# Altium schematic sheet SH1 - HSD.SchDoc: HSD
size B; Engineer: Tibi Andronescu; Revision: 1; SheetNumber: 1; SheetTotal: 1
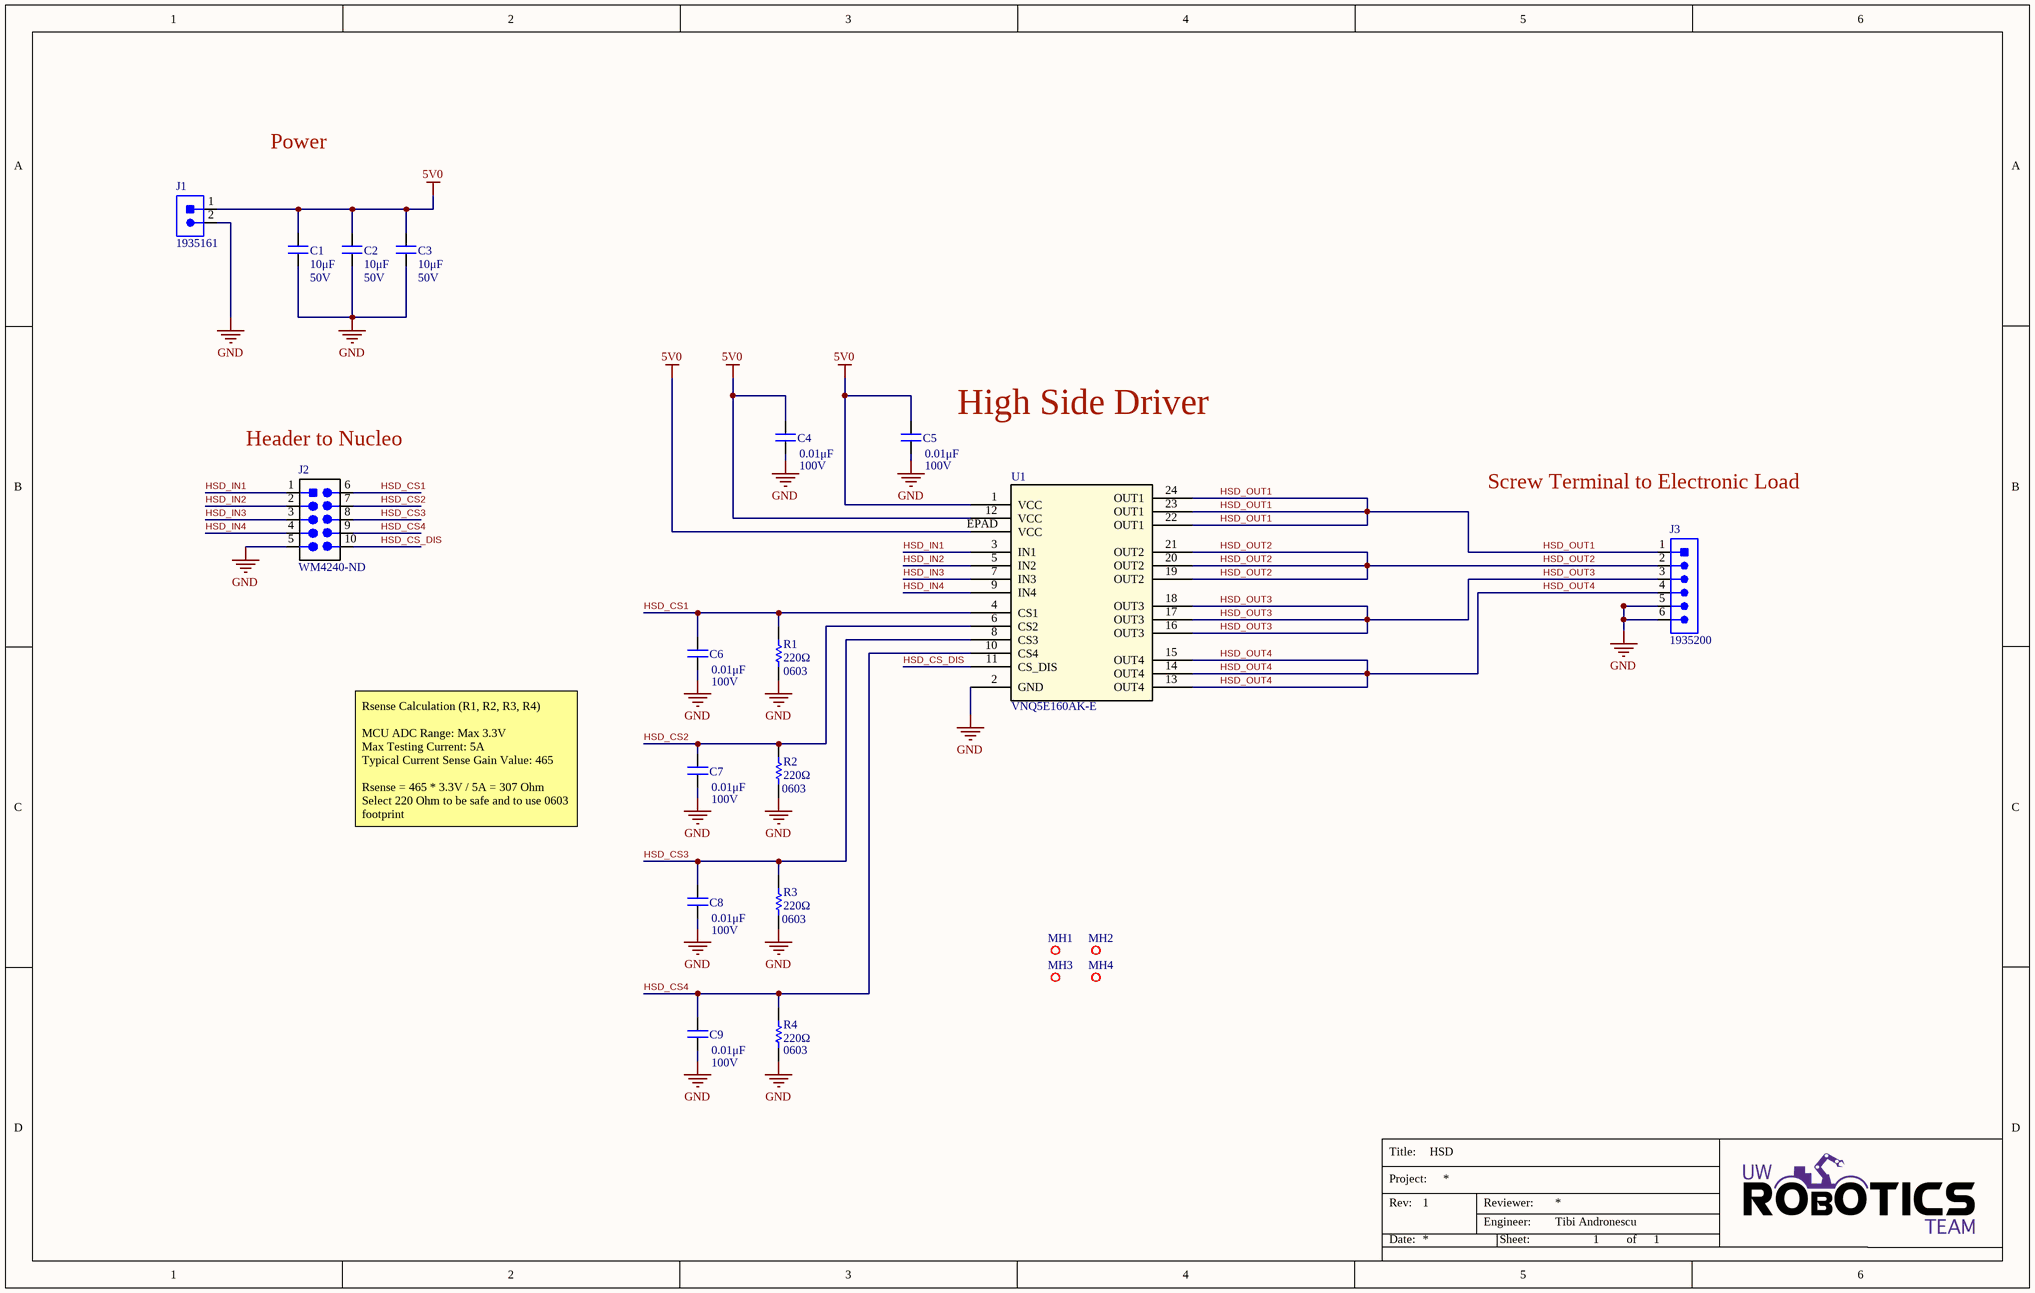
[diagram p0: SH1 - HSD.SchDoc]

## Parts
C1  value 10μF  Voltage Rating: 50V  [CAP1206]  (hidden comment: CAP_10uF_50V_1206)
C2  value 10μF  Voltage Rating: 50V  [CAP1206]  (hidden comment: CAP_10uF_50V_1206)
C3  value 10μF  Voltage Rating: 50V  [CAP1206]  (hidden comment: CAP_10uF_50V_1206)
C4  value 0.01μF  Voltage Rating: 100V  [CAP0603]  (hidden comment: CAP_0.01uF_100V_0603)
C5  value 0.01μF  Voltage Rating: 100V  [CAP0603]  (hidden comment: CAP_0.01uF_100V_0603)
C6  value 0.01μF  Voltage Rating: 100V  [CAP0603]  (hidden comment: CAP_0.01uF_100V_0603)
C7  value 0.01μF  Voltage Rating: 100V  [CAP0603]  (hidden comment: CAP_0.01uF_100V_0603)
C8  value 0.01μF  Voltage Rating: 100V  [CAP0603]  (hidden comment: CAP_0.01uF_100V_0603)
C9  value 0.01μF  Voltage Rating: 100V  [CAP0603]  (hidden comment: CAP_0.01uF_100V_0603)
J1  CON_2M_TERM  [1935161]  (value not drawn)
J2  Supplier Part Number 1: WM4240-ND  [HEADER 2X5]  (hidden comment: HEADER 5x2)
J3  CON_6POS_SCREW_TERM  [1935200]  (value not drawn)
MH1  MOUNTING_HOLE_M3  [MOUNTING_HOLE_3mm]  (value not drawn)  (no BOM)
MH2  MOUNTING_HOLE_M3  [MOUNTING_HOLE_3mm]  (value not drawn)  (no BOM)
MH3  MOUNTING_HOLE_M3  [MOUNTING_HOLE_3mm]  (value not drawn)  (no BOM)
MH4  MOUNTING_HOLE_M3  [MOUNTING_HOLE_3mm]  (value not drawn)  (no BOM)
R1  value 220Ω  Package/Footprint: 0603  [RESC0603]  (hidden comment: RES_220Ω_0603)
R2  value 220Ω  Package/Footprint: 0603  [RESC0603]  (hidden comment: RES_220Ω_0603)
R3  value 220Ω  Package/Footprint: 0603  [RESC0603]  (hidden comment: RES_220Ω_0603)
R4  value 220Ω  Package/Footprint: 0603  [RESC0603]  (hidden comment: RES_220Ω_0603)
U1  VNQ5E160AK-E  [PowerSSO-24_STM]

## Nets
5V0: C1.2 C2.2 C3.2 C4.2 C5.2 J1.1 U1.1(VCC) U1.12(VCC) U1.EPAD(VCC)
GND: C1.1 C2.1 C3.1 C4.1 C5.1 C6.1 C7.1 C8.1 C9.1 J1.2 J2.5 J3.5 J3.6 R1.1 R2.1 R3.1 R4.1 U1.2(GND)
HSD_CS1: C6.2 J2.6(GND) R1.2 U1.4(CS1)
HSD_CS2: C7.2 J2.7 R2.2 U1.6(CS2)
HSD_CS3: C8.2 J2.8 R3.2 U1.8(CS3)
HSD_CS4: C9.2 J2.9 R4.2 U1.10(CS4)
HSD_CS_DIS: J2.10 U1.11(CS_DIS)
HSD_IN1: J2.1(VCC) U1.3(IN1)
HSD_IN2: J2.2 U1.5(IN2)
HSD_IN3: J2.3 U1.7(IN3)
HSD_IN4: J2.4 U1.9(IN4)
HSD_OUT1: J3.1 U1.22(OUT1) U1.23(OUT1) U1.24(OUT1)
HSD_OUT2: J3.2 U1.19(OUT2) U1.20(OUT2) U1.21(OUT2)
HSD_OUT3: J3.3 U1.16(OUT3) U1.17(OUT3) U1.18(OUT3)
HSD_OUT4: J3.4 U1.13(OUT4) U1.14(OUT4) U1.15(OUT4)

## Notes on the sheet
- Power
- High Side Driver
- (near J2) Header to Nucleo
- Screw Terminal to Electronic Load
- Rsense Calculation (R1, R2, R3, R4)
  MCU ADC Range: Max 3.3V
  Max Testing Current: 5A
  Typical Current Sense Gain Value: 465
  Rsense = 465 * 3.3V / 5A = 307 Ohm
  Select 220 Ohm to be safe and to use 0603 footprint
- Title:
- Project:
- Date:
- Rev:
- Reviewer:
- Engineer:
- Sheet:
- of

## Library data of the parts
C1-C3 = CAP_10uF_50V_1206: CAP CER 10UF 50V X5R 1206; Manufacturer 1: Murata; Manufacturer Part Number 1: GRT31CR61H106KE01L; Package/Footprint: 1206; Supplier Part Number 1: 490-12456-1-ND; Supplier 1: Digi-Key; Mounting Type: SMD; Dielectric: X5R
C4-C9 = CAP_0.01uF_100V_0603: CAP CER 10000PF 100V X7R 0603; Manufacturer Part Number 1: GCM188R72A103KA37J; Manufacturer 1: Murata Electronics; Supplier Part Number 1: 490-8028-1-ND; Supplier 1: Digi-Key; Dielectric: X7R
J1 = CON_2M_TERM: TERM BLK 2POS SIDE ENTRY 5MM; Manufacturer 1: Phoenix Contact; Max Current Rating: 16A; Current: 18A; Voltage: 300V; Package/Footprint: SMD; Supplier 1: Digi-Key; Supplier Part Number 1: 277-1667-ND; Manufacturer Part Number 1: 1935161; Mounting Type: TH
J2 = HEADER 5x2: CONN HEADER VERT 10POS 2.54MM; Manufacturer 1: Molex; Manufacturer Part Number 1: 0901512210; Number of Positions: 10; Connector Type: Receptacle; Pitch: 0.1inch; Supplier 1: Digi-Key; Category: Headers and Wire Housings; Stock 1: 3613; Mount: Through Hole; Contact Plating: Gold; Contact Material: Bronze; Housing Material: Polyester; Color: Black; Housing Color: Black; Min Operating Temperature: -55°C; Max Operating Temperature: 125°C; Number of Rows: 2; Packaging: Rail/Tube; Termination: Solder; Number of Contacts: 10; Orientation: Straight; Series: C-Grid III™ 90151; Contact Type: Female Socket; Length: 12.7mm; Row Spacing: 0.1inch; Depth: 5.08mm; RoHS Compliant: Yes; ComponentLink1URL: https://datasheet.ciiva.com/755/901512210-sd-755814.pdf?src-supplier=Digi-Key; ComponentLink1Description: https://datasheet.ciiva.com/755/901512210-sd-755814.pdf?src-supplier=Digi-Key; Verified: No
J3 = CON_6POS_SCREW_TERM: TERM BLK 6POS SIDE ENTRY 5MM; Manufacturer 1: Phoenix Contact; Wire Gauge: 12-26AWG; Package/Footprint: TH; Screw Thread: M2.6; Supplier Part Number 1: 277-1581-ND; Supplier 1: Digi-Key; Pitch: 5mm; Mounting Type: TH; Manufacturer Part Number 1: 1935200
R1-R4 = RES_220Ω_0603_5%: RES 220 OHM 5% 1/10W 0603; Manufacturer 1: Yageo; Manufacturer Part Number 1: AC0603JR-07220RL; Supplier Part Number 1: YAG3652CT-ND; Supplier 1: Digi-Key
U1 = VNQ5E160AK-E: Power Switch/Driver 1:1 N-Channel 7A PowerSSO-24; Manufacturer 1: STMicroelectronics; Number of Outputs: 4; On-State Resistance: 160mR; Max Output Current: 10A; Output Configuration: High Side; Load Voltage: 4.5V ~ 28V; Rds On (Typ): 160mOhm (Max); Supplier 1: Digi-Key; Manufacturer Part Number 1: VNQ5E160AK-E; Category: Hot Swap Controllers; Mounting Type: SM; Number of Pins: 24; Min Operating Temperature: -40°C; Max Operating Temperature: 150°C; Series: VIPower™; Output Current per Channel: 7A; Lead Free: Lead Free; ComponentLink1URL: https://datasheet.ciiva.com/1956/cd00163285-1956669.pdf?src-supplier=Digi-Key; ComponentLink1Description: https://datasheet.ciiva.com/1956/cd00163285-1956669.pdf?src-supplier=Digi-Key; Supplier Part Number 1: 497-19256-ND; Verified: No